# Altium project air_pod_case.PrjPcb
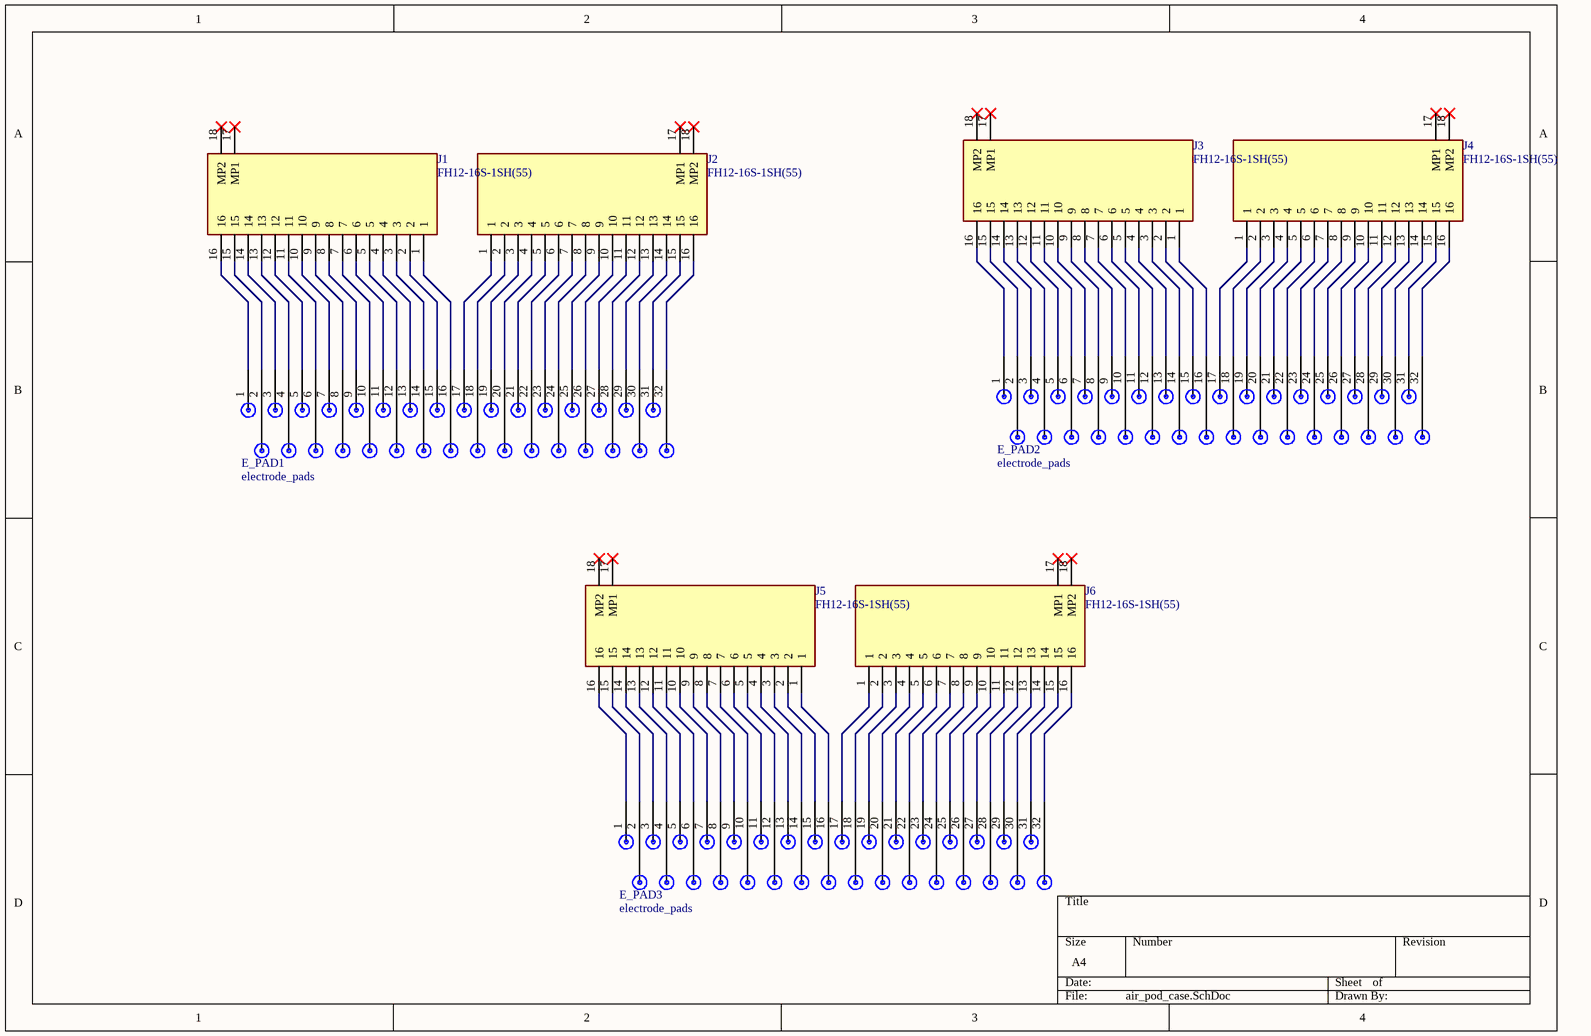
[diagram p0: air_pod_case.SchDoc]
1 sheet, 9 parts. Net scope: global (net labels, ports and power ports of the same name join across sheets).
Board file: air_pod_case_ASCII2.PcbDoc

## Sheet air_pod_case.SchDoc
size A4; SheetNumber: 1; SheetTotal: 1

### Parts
E_PAD1  electrode_pads  [32_electrode_pads]
E_PAD2  electrode_pads  [32_electrode_pads]
E_PAD3  electrode_pads  [32_electrode_pads]
J1  FH12-16S-1SH(55)  [FH12-16S-1SH(55)]
J2  FH12-16S-1SH(55)  [FH12-16S-1SH(55)]
J3  FH12-16S-1SH(55)  [FH12-16S-1SH(55)]
J4  FH12-16S-1SH(55)  [FH12-16S-1SH(55)]
J5  FH12-16S-1SH(55)  [FH12-16S-1SH(55)]
J6  FH12-16S-1SH(55)  [FH12-16S-1SH(55)]

### Nets
NetE_PAD1_1: E_PAD1.1 J1.16
NetE_PAD1_2: E_PAD1.2 J1.15
NetE_PAD1_3: E_PAD1.3 J1.14
NetE_PAD1_4: E_PAD1.4 J1.13
NetE_PAD1_5: E_PAD1.5 J1.12
NetE_PAD1_6: E_PAD1.6 J1.11
NetE_PAD1_7: E_PAD1.7 J1.10
NetE_PAD1_8: E_PAD1.8 J1.9
NetE_PAD1_9: E_PAD1.9 J1.8
NetE_PAD1_10: E_PAD1.10 J1.7
NetE_PAD1_11: E_PAD1.11 J1.6
NetE_PAD1_12: E_PAD1.12 J1.5
NetE_PAD1_13: E_PAD1.13 J1.4
NetE_PAD1_14: E_PAD1.14 J1.3
NetE_PAD1_15: E_PAD1.15 J1.2
NetE_PAD1_16: E_PAD1.16 J1.1
NetE_PAD1_17: E_PAD1.17 J2.1
NetE_PAD1_18: E_PAD1.18 J2.2
NetE_PAD1_19: E_PAD1.19 J2.3
NetE_PAD1_20: E_PAD1.20 J2.4
NetE_PAD1_21: E_PAD1.21 J2.5
NetE_PAD1_22: E_PAD1.22 J2.6
NetE_PAD1_23: E_PAD1.23 J2.7
NetE_PAD1_24: E_PAD1.24 J2.8
NetE_PAD1_25: E_PAD1.25 J2.9
NetE_PAD1_26: E_PAD1.26 J2.10
NetE_PAD1_27: E_PAD1.27 J2.11
NetE_PAD1_28: E_PAD1.28 J2.12
NetE_PAD1_29: E_PAD1.29 J2.13
NetE_PAD1_30: E_PAD1.30 J2.14
NetE_PAD1_31: E_PAD1.31 J2.15
NetE_PAD1_32: E_PAD1.32 J2.16
NetE_PAD2_1: E_PAD2.1 J3.16
NetE_PAD2_2: E_PAD2.2 J3.15
NetE_PAD2_3: E_PAD2.3 J3.14
NetE_PAD2_4: E_PAD2.4 J3.13
NetE_PAD2_5: E_PAD2.5 J3.12
NetE_PAD2_6: E_PAD2.6 J3.11
NetE_PAD2_7: E_PAD2.7 J3.10
NetE_PAD2_8: E_PAD2.8 J3.9
NetE_PAD2_9: E_PAD2.9 J3.8
NetE_PAD2_10: E_PAD2.10 J3.7
NetE_PAD2_11: E_PAD2.11 J3.6
NetE_PAD2_12: E_PAD2.12 J3.5
NetE_PAD2_13: E_PAD2.13 J3.4
NetE_PAD2_14: E_PAD2.14 J3.3
NetE_PAD2_15: E_PAD2.15 J3.2
NetE_PAD2_16: E_PAD2.16 J3.1
NetE_PAD2_17: E_PAD2.17 J4.1
NetE_PAD2_18: E_PAD2.18 J4.2
NetE_PAD2_19: E_PAD2.19 J4.3
NetE_PAD2_20: E_PAD2.20 J4.4
NetE_PAD2_21: E_PAD2.21 J4.5
NetE_PAD2_22: E_PAD2.22 J4.6
NetE_PAD2_23: E_PAD2.23 J4.7
NetE_PAD2_24: E_PAD2.24 J4.8
NetE_PAD2_25: E_PAD2.25 J4.9
NetE_PAD2_26: E_PAD2.26 J4.10
NetE_PAD2_27: E_PAD2.27 J4.11
NetE_PAD2_28: E_PAD2.28 J4.12
NetE_PAD2_29: E_PAD2.29 J4.13
NetE_PAD2_30: E_PAD2.30 J4.14
NetE_PAD2_31: E_PAD2.31 J4.15
NetE_PAD2_32: E_PAD2.32 J4.16
NetE_PAD3_1: E_PAD3.1 J5.16
NetE_PAD3_2: E_PAD3.2 J5.15
NetE_PAD3_3: E_PAD3.3 J5.14
NetE_PAD3_4: E_PAD3.4 J5.13
NetE_PAD3_5: E_PAD3.5 J5.12
NetE_PAD3_6: E_PAD3.6 J5.11
NetE_PAD3_7: E_PAD3.7 J5.10
NetE_PAD3_8: E_PAD3.8 J5.9
NetE_PAD3_9: E_PAD3.9 J5.8
NetE_PAD3_10: E_PAD3.10 J5.7
NetE_PAD3_11: E_PAD3.11 J5.6
NetE_PAD3_12: E_PAD3.12 J5.5
NetE_PAD3_13: E_PAD3.13 J5.4
NetE_PAD3_14: E_PAD3.14 J5.3
NetE_PAD3_15: E_PAD3.15 J5.2
NetE_PAD3_16: E_PAD3.16 J5.1
NetE_PAD3_17: E_PAD3.17 J6.1
NetE_PAD3_18: E_PAD3.18 J6.2
NetE_PAD3_19: E_PAD3.19 J6.3
NetE_PAD3_20: E_PAD3.20 J6.4
NetE_PAD3_21: E_PAD3.21 J6.5
NetE_PAD3_22: E_PAD3.22 J6.6
NetE_PAD3_23: E_PAD3.23 J6.7
NetE_PAD3_24: E_PAD3.24 J6.8
NetE_PAD3_25: E_PAD3.25 J6.9
NetE_PAD3_26: E_PAD3.26 J6.10
NetE_PAD3_27: E_PAD3.27 J6.11
NetE_PAD3_28: E_PAD3.28 J6.12
NetE_PAD3_29: E_PAD3.29 J6.13
NetE_PAD3_30: E_PAD3.30 J6.14
NetE_PAD3_31: E_PAD3.31 J6.15
NetE_PAD3_32: E_PAD3.32 J6.16

Not connected (* = marked no-connect by the designer): J1 17(MP1)* 18(MP2)*; J2 17(MP1)* 18(MP2)*; J3 17(MP1)* 18(MP2)*; J4 17(MP1)* 18(MP2)*; J5 17(MP1)* 18(MP2)*; J6 17(MP1)* 18(MP2)*